# Altium schematic sheet Power.SchDoc
size A4
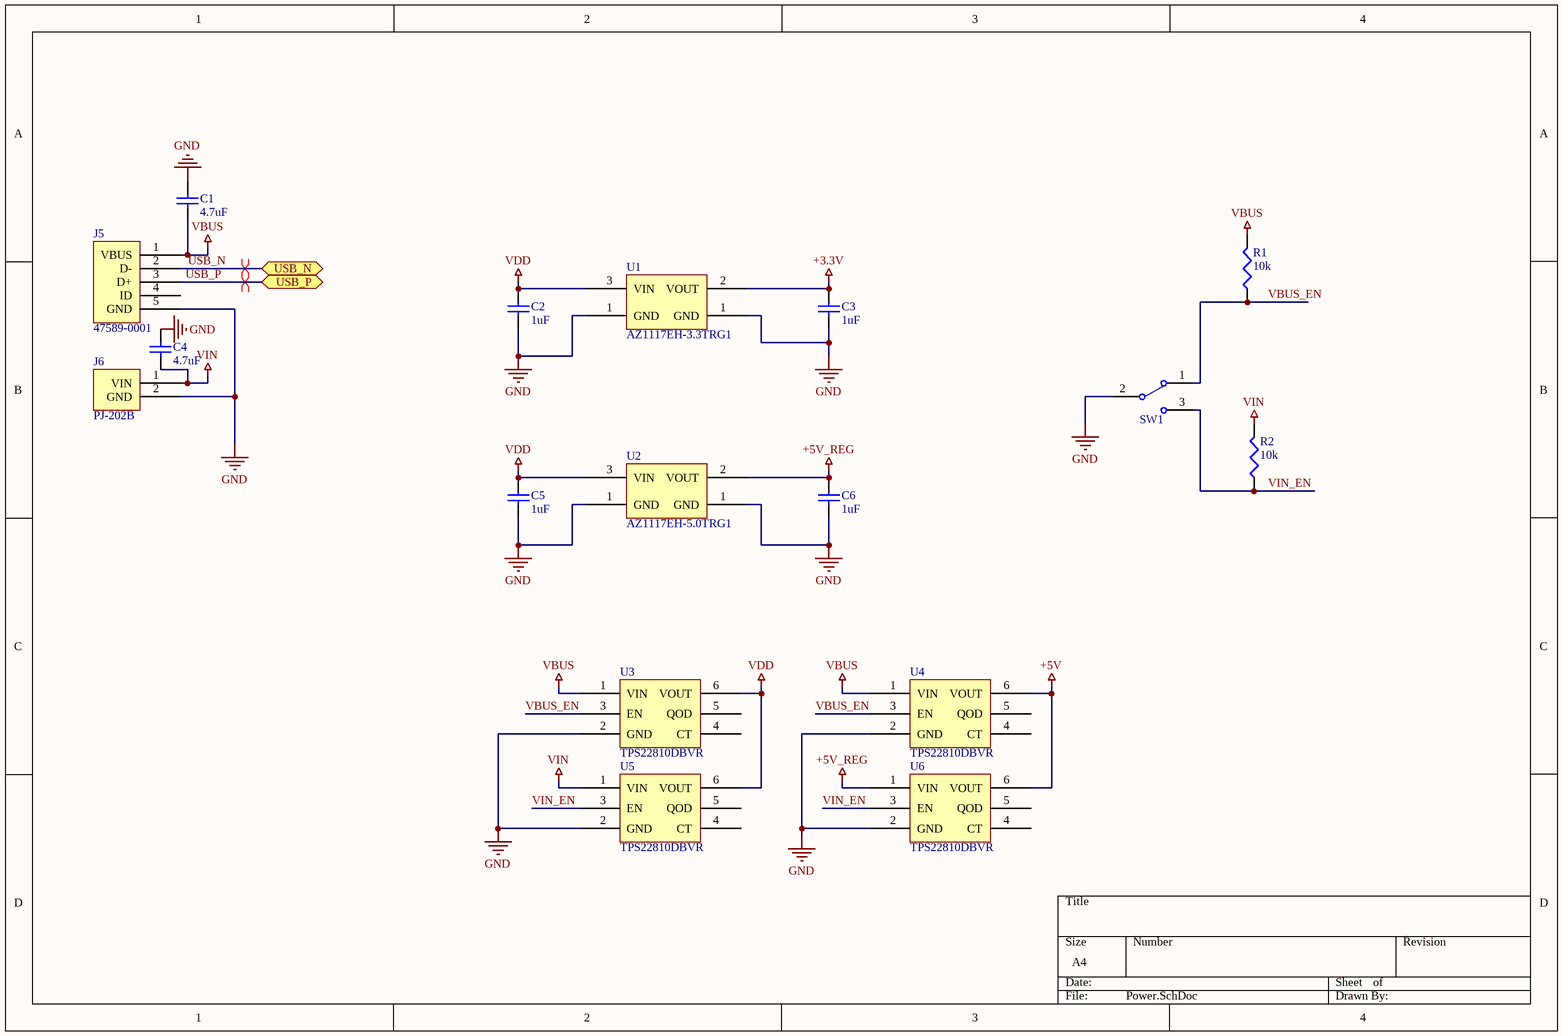
[diagram p0: Power.SchDoc]

## Parts
C1  value 4.7uF  [CAPC2013X14N]  (hidden comment: CL21A475KAQNNNE)
C2  value 1uF  [CAPC1608X09N_2]  (hidden comment: CL10A105KA8NNNC)
C3  value 1uF  [CAPC1608X09N_2]  (hidden comment: CL10A105KA8NNNC)
C4  value 4.7uF  [CAPC2013X14N]  (hidden comment: CL21A475KAQNNNE)
C5  value 1uF  [CAPC1608X09N_2]  (hidden comment: CL10A105KA8NNNC)
C6  value 1uF  [CAPC1608X09N_2]  (hidden comment: CL10A105KA8NNNC)
J5  47589-0001  [USB]
J6  PJ-202B  [POWER_JACK]
R1  value 10k  [RESC1608X05N]  (hidden comment: RR0816P-103-D)
R2  value 10k  [RESC1608X05N]  (hidden comment: RR0816P-103-D)
SW1  OS102011MS2QN1  [DIP5-SW]  (value not drawn)
U1  AZ1117EH-3.3TRG1  [SOT230P700X180-4N]
U2  AZ1117EH-5.0TRG1  [SOT230P700X180-4N]
U3  TPS22810DBVR  [SOT23127P600-8N-TPS22810DBVR]
U4  TPS22810DBVR  [SOT23127P600-8N-TPS22810DBVR]
U5  TPS22810DBVR  [SOT23127P600-8N-TPS22810DBVR]
U6  TPS22810DBVR  [SOT23127P600-8N-TPS22810DBVR]

## Ports
USB_N, USB_P

## Nets
+3.3V: C3.2 U1.2(VOUT)
+5V: U4.6(VOUT) U6.6(VOUT)
+5V_REG: C6.2 U2.2(VOUT) U6.1(VIN)
GND: C1.1 C2.1 C3.1 C4.1 C5.1 C6.1 J5.5(GND) J6.2(GND) J6.3(GND) SW1.2 U1.1(GND) U2.1(GND) U3.2(GND) U4.2(GND) U5.2(GND) U6.2(GND)
VBUS: C1.2 J5.1(VBUS) R1.2 U3.1(VIN) U4.1(VIN)
VDD: C2.2 C5.2 U1.3(VIN) U2.3(VIN) U3.6(VOUT) U5.6(VOUT)
VIN: C4.2 J6.1(VIN) R2.2 U5.1(VIN)
USB_N: J5.2(D-) ; port USB_N
USB_P: J5.3(D+) ; port USB_P
VBUS_EN: R1.1 SW1.1 U3.3(EN) U4.3(EN)
VIN_EN: R2.1 SW1.3 U5.3(EN) U6.3(EN)

Not connected (* = marked no-connect by the designer): J5 4(ID); U3 4(CT) 5(QOD); U4 4(CT) 5(QOD); U5 4(CT) 5(QOD); U6 4(CT) 5(QOD)

## Layout directives
differential pair; net class USB: USB_N, USB_P

## Library data of the parts
C1 C4 = CL21A475KAQNNNE: Cap Ceramic 4.7uF 25V X5R 10% SMD 0805 85C Embossed T/R; Manufacturer: Samsung; Supplier 1: Digi-Key; Manufacturer Part Number: CL21A475KAQNNNE; Stock 1: 20000; Pricing 1: 1=0.23, 10=0.158, 100=0.0802, 500=0.0549, 1000=0.0485 (USD); Mount: Surface Mount; Case/Package: 0805; Case Code (Metric): 2012; Case Code (Imperial): 0805; Min Operating Temperature: -55°C; Max Operating Temperature: 85°C; Package Quantity: 1; Packaging: Tape and Reel; Capacitance: 4.7uF; Tolerance: 10%; Voltage Rating: 25V; Dielectric: X5R; Voltage Rating (DC): 25V; Length: 2mm; Height: 1.25mm; Width: 0.049inch; Thickness: 0.055inch; Depth: 1.25mm; Radiation Hardening: No; Lead Free: Lead Free; Supplier Part Number 1: 1276-1244-1-ND
C2 C3 C5 C6 = CL10A105KA8NNNC: Cap Ceramic 1uF 25V X5R 10% SMD 0603 85C Paper T/R; Manufacturer: Samsung; Supplier 1: Digi-Key; Manufacturer Part Number: CL10A105KA8NNNC; Stock 1: 40000; Pricing 1: 1=0.1, 10=0.052, 100=0.0231, 500=0.0165, 1000=0.013 (USD); Mount: Surface Mount; Case/Package: 0603; Case Code (Metric): 1608; Case Code (Imperial): 0603; Material: Ceramic; Contact Plating: Tin; Min Operating Temperature: -55°C; Max Operating Temperature: 85°C; Capacitance: 1uF; Tolerance: 10%; Dielectric: X5R; Voltage: 25V; Voltage Rating (DC): 25V; Packaging: Tape and Reel; Package Quantity: 1; Voltage Rating: 25V; Length: 1.6mm; Height: 0.8mm; Depth: 0.8mm; Width: 0.031inch; Thickness: 0.035inch; Radiation Hardening: No; Lead Free: Lead Free; Supplier Part Number 1: 1276-1102-1-ND
J5 = 47589-0001: MOLEX         47589-0001            MICRO USB, 2.0 TYPE AB, RECEPTACLE, SMT; Max Voltage Rating (AC): 100V; Gender: Female; Connector Type: Receptacle,USB; Number of Ports: 1; Number of Contacts: 5; Contact Resistance: 40mR; Current Rating: 1.8A; Voltage Rating (AC): 30V; USB Standard: USB 2.0; Pitch: 0.65mm; Checked: False; Supplier 1: Digi-Key; Manufacturer: Molex; Manufacturer Part Number: 47589-0001; Stock 1: 66825; Pricing 1: 1=0.74, 10=0.649, 25=0.6108, 50=0.5854, 100=0.56, 250=0.5091, 500=0.4582 (USD); Mount: PCB,Surface Mount; Weight: 0.01lb; Contact Plating: Gold; Contact Material: Copper,Copper Alloy; Number of Terminals: 5; Housing Material: Polymer; Colour: Black; Min Operating Temperature: -20°C; Max Operating Temperature: 85°C; Packaging: Tape and Reel; Termination: Solder; Orientation: Right Angle; Voltage Rating: 30V; Length: 8.65mm; Height: 0.25inch; Width: 0.25inch; Radiation Hardening: No; REACH SVHC: Unknown; Supplier Part Number 1: WM17143CT-ND
J6 = PJ-202B: PJ-202 Series 2.5 x 6.5 mm 16 V Horizontal Power Jack w/ Kinked Pins; Manufacturer: CUI; Shielding: Unshielded; Current Rating: 2.5A; Voltage Rating: 24V; Gender: Male; Insulation Resistance: 100MR; Number of Conductors: 2; Supplier 1: Digi-Key; Manufacturer Part Number: PJ-202B; Stock 1: 39597; Pricing 1: 1=0.61, 10=0.57, 25=0.5132, 50=0.456, 100=0.437, 250=0.399, 500=0.38, 1000=0.3135, 2500=0.285 (USD); Mount: Through Hole; Contact Plating: Nickel; Colour: Black; Contact Material: Copper; Housing Colour: Black; Housing Material: Thermoplastic; Min Operating Temperature: -25°C; Max Operating Temperature: 85°C; Package Quantity: 500; Packaging: Bulk; Termination: Through Hole; Connector Type: Jack; Orientation: Horizontal; Contact Gender: Male; Diameter: 2.5mm; Lead Free: Lead Free; Flammability Rating: UL94 V-0; Supplier Part Number 1: CP-202B-ND
R1 R2 = RR0816P-103-D: RES SMD 10K OHM 0.5% 1/16W 0603; Manufacturer: Susumu; Power (Watts): 0.063W, 1/16W; Temperature Coefficient: ±25ppm/°C; Supplier 1: Digi-Key; Manufacturer Part Number: RR0816P-103-D; RoHS: RoHS Compliant; Category: Resistors; Stock 1: 362461; Pricing 1: 1=0.09, 10=0.084, 100=0.0321, 1000=0.01412, 2500=0.01219 (EUR); Packaging: Cut Tape (CT); Part Status: Active; Tolerance: ±0.5%; Composition: Thin Film; Features: -; Operating Temperature: -55°C ~ 125°C; Package / Case: 0603 (1608 Metric); Supplier Device Package: -; Size / Dimension: 0.063" L x 0.032" W (1.60mm x 0.80mm); Height - Seated (Max): 0.020" (0.50mm); Failure Rate: -; ComponentLink1URL: http://www.susumu.co.jp/common/pdf/n_catalog_partition05_en.pdf; ComponentLink1Description: http://www.susumu.co.jp/common/pdf/n_catalog_partition05_en.pdf; Supplier Part Number 1: RR08P10.0KDCT-ND
SW1 = OS102011MS2QN1: C & K COMPONENTS         OS102011MS2QN1             Slide Switch, SPDT, On-On, Through Hole, OS Series, 100 mA; Manufacturer: ITT C&K; Mechanical Life: 10000Cycles; Actuator Material: Acetal,Polyacetal,Polyoxymethylene; Max Current Rating: 100mA; Voltage Rating (DC): 12V; Contact Resistance: 20mR; Contact Style: Non-Shorting; Insulation Resistance: 100MR; Switch Travel: 2mm; Actuator Type: Standard; Actuator Length: 4mm; Supplier 1: Digi-Key; Manufacturer Part Number: OS102011MS2QN1; Stock 1: 29366; Pricing 1: 1=0.43, 10=0.413, 25=0.4048, 50=0.3616, 100=0.3444, 250=0.3358, 500=0.2841, 1000=0.2755, 5000=0.2411 (USD); Mount: PCB,Through Hole; Contact Material: Brass,Copper Alloy,Silver; Contact Plating: Gold,Silver; Housing Material: Resin; Min Operating Temperature: -30°C; Max Operating Temperature: 70°C; Throw Configuration: SPDT; Packaging: Bulk; Max Voltage Rating (DC): 12V; Package Quantity: 300; Contact Current Rating: 100mA; Current Rating: 100mA; Termination: PC Pins; Electrical Life: 10000Cycles; Orientation: Vertical; Switch Function: On-On; Length: 8.6mm; Depth: 4.3mm; Radiation Hardening: No; REACH SVHC: No SVHC; Lead Free: Lead Free; Supplier Part Number 1: CKN9565-ND
U1 = AZ1117EH-3.3TRG1: LDO Voltage Regulators LDO BJT HiCurr; Manufacturer: Diodes; Output Voltage: 3.3V; Output Current: 1A; Dropout Voltage: 1.1V; Number of Regulators: 1; Max Input Voltage: 13V; Operating Supply Current: 3.5mA; Power Supply Rejection Ratio (PSRR): 70dB; Polarity: Positive; Accuracy: 1%; Reference Voltage: 1.262V; Output Type: Fixed; Supplier 1: Digi-Key; Manufacturer Part Number: AZ1117EH-3.3TRG1; Stock 1: 97054; Pricing 1: 1=0.43, 10=0.321, 100=0.1815, 500=0.1202, 1000=0.0922 (USD); Mount: Surface Mount; Case/Package: TO-261-4; Number of Pins: 3; Weight: 0.000282oz; Contact Plating: Tin; Min Operating Temperature: -40°C; Max Operating Temperature: 125°C; Packaging: Tape and Reel; Number of Outputs: 1; Package Quantity: 4000; Quiescent Current: 3.5mA; Max Output Current: 1A; Lead Free: Lead Free; Supplier Part Number 1: AZ1117EH-3.3TRG1DICT-ND
U2 = AZ1117EH-5.0TRG1: LDO Voltage Regulators LDO BJT HiCurr 1A 1.15V to 12V; Manufacturer: Diodes; Output Voltage: 5V; Dropout Voltage: 1.1V; Number of Regulators: 1; Max Input Voltage: 13V; Operating Supply Current: 3.5mA; Power Supply Rejection Ratio (PSRR): 70dB; Polarity: Positive; Accuracy: 1%; Reference Voltage: 1.262V; Output Type: Fixed; Supplier 1: Digi-Key; Manufacturer Part Number: AZ1117EH-5.0TRG1; Stock 1: 41027; Pricing 1: 1=0.43, 10=0.321, 100=0.1815, 500=0.1202, 1000=0.0922 (USD); Mount: Surface Mount; Case/Package: TO-261-4; Number of Pins: 3; Weight: 0.000282oz; Min Operating Temperature: -40°C; Max Operating Temperature: 125°C; Packaging: Tape and Reel; Output Current: 1A; Number of Outputs: 1; Package Quantity: 4000; Quiescent Current: 3.5mA; Max Output Current: 1A; Supplier Part Number 1: AZ1117EH-5.0TRG1DICT-ND